# EAGLE design pedalboard (EAGLE 6.3)
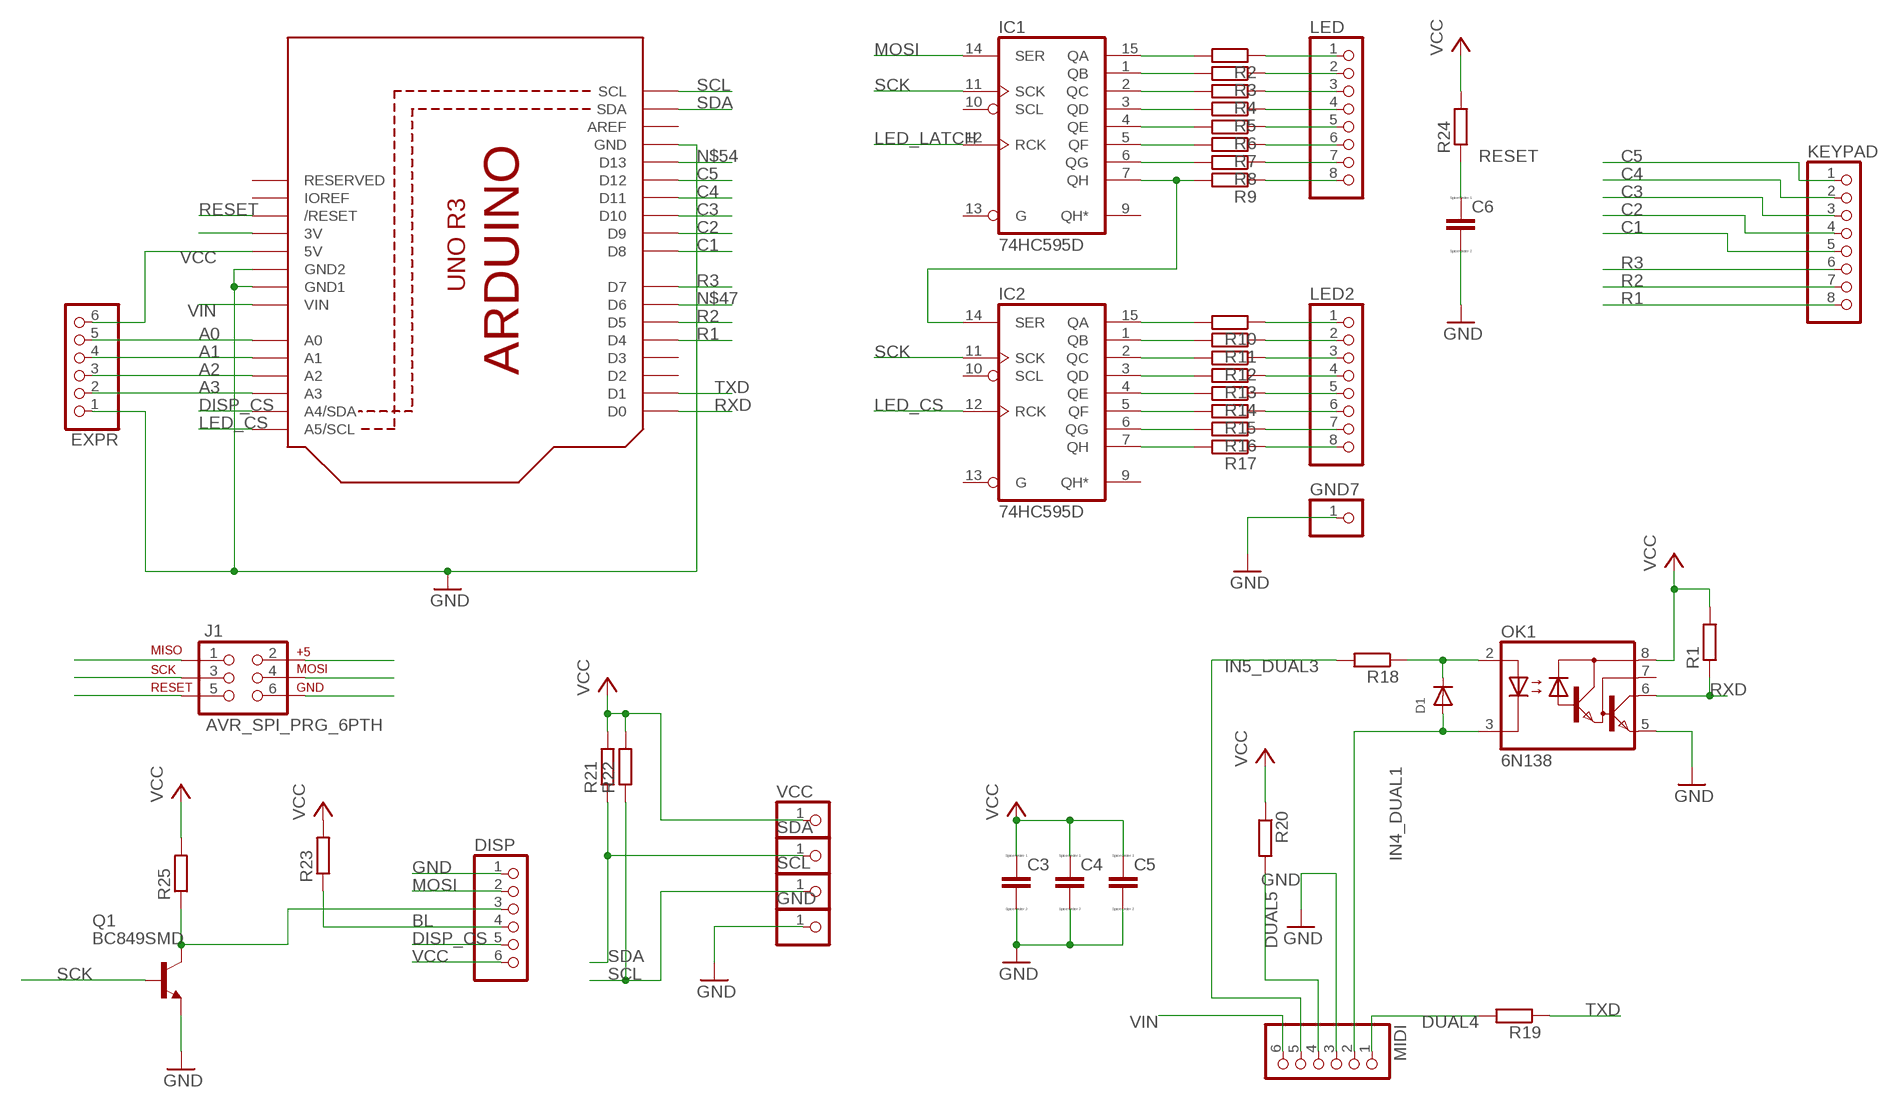
[diagram p0: schematic, sheet 1]

## Parts
C3  CC0603  [C0603]
C4  CC0603  [C0603]
C5  C  [C0805]
C6  CC0603  [C0603]
D1  DIODEDO-1N4148  [DO-1N4148]
DISP  PINHD-1X6  [1X06]
EXPR  PINHD-1X6  [1X06]
GND  PINHD-1X1  [1X01]
GND7  PINHD-1X1  [1X01]
IC1  74HC595D  [SO16]
IC2  74HC595D  [SO16]
J1  AVR_SPI_PRG_6PTH  [2X3]
KEYPAD  PINHD-1X8CLEANBIG  [1X08-CLEANBIG]
LED  PINHD-1X8CLEANBIG  [1X08-CLEANBIG]
LED2  PINHD-1X8CLEANBIG  [1X08-CLEANBIG]
MIDI  PINHD-1X6  [1X06]
OK1  6N138  [DIL08]
Q1  BC849SMD  [SOT23-BEC]
R1  R-EU_R0805  [R0805]
R2  R-EU_R0805  [R0805]
R3  R-EU_R0805  [R0805]
R4  R-EU_R0805  [R0805]
R5  R-EU_R0805  [R0805]
R6  R-EU_R0805  [R0805]
R7  R-EU_R0805  [R0805]
R8  R-EU_R0805  [R0805]
R9  R-EU_R0805  [R0805]
R10  R-EU_R0805  [R0805]
R11  R-EU_R0805  [R0805]
R12  R-EU_R0805  [R0805]
R13  R-EU_R0805  [R0805]
R14  R-EU_R0805  [R0805]
R15  R-EU_R0805  [R0805]
R16  R-EU_R0805  [R0805]
R17  R-EU_R0805  [R0805]
R18  R-EU_R0805  [R0805]
R19  R-EU_R0805  [R0805]
R20  R-EU_R0805  [R0805]
R21  R-EU_R0805  [R0805]
R22  R-EU_R0805  [R0805]
R23  R-EU_R0805  [R0805]
R24  R-EU_R0805  [R0805]
R25  R-EU_R0805  [R0805]
SCL  PINHD-1X1  [1X01]
SDA  PINHD-1X1  [1X01]
U2  ARDUINOR3-BPLACE  [ARDUINOR3-BPLACE]
VCC  PINHD-1X1  [1X01]

## Nets
A0: EXPR.5 U2.A0
A1: EXPR.4 U2.A1
A2: EXPR.3 U2.A2
A3: EXPR.2 U2.A3
BL: DISP.4 R23.1
C1: KEYPAD.5 U2.D8
C2: KEYPAD.4 U2.D9
C3: KEYPAD.3 U2.D10
C4: KEYPAD.2 U2.D11
C5: KEYPAD.1 U2.D12
DISP_CS: DISP.5 U2.A4(A4/SDA)
DUAL4: MIDI.1 R19.2
DUAL5: MIDI.4 R20.2
GND: C3.2 C4.2 C5.2 C6.2 DISP.1 EXPR.1 GND7.1 GND.1 J1.6 MIDI.3 OK1.5(GND) Q1.E U2.GND U2.GND1 U2.GND2
IN4_DUAL1: D1.A MIDI.2 OK1.3(C)
IN5_DUAL3: MIDI.5 R18.2
LED2: LED2.1 R10.1
LED_CS: IC2.12(RCK) U2.A5(A5/SCL)
LED_LATCH: IC1.12(RCK)
MISO: J1.1
MOSI: DISP.2 IC1.14(SER) J1.4
N$1: IC1.7(QH) IC2.14(SER) R9.2
N$2: IC2.4(QE) R14.2
N$3: IC2.5(QF) R15.2
N$4: IC1.15(QA) R2.2
N$5: IC1.1(QB) R3.2
N$6: IC1.2(QC) R4.2
N$7: IC1.3(QD) R5.2
N$8: IC1.4(QE) R6.2
N$9: IC1.5(QF) R7.2
N$10: IC1.6(QG) R8.2
N$11: IC2.15(QA) R10.2
N$12: IC2.1(QB) R11.2
N$13: IC2.2(QC) R12.2
N$14: IC2.3(QD) R13.2
N$15: IC2.6(QG) R16.2
N$16: IC2.7(QH) R17.2
N$17: DISP.3 Q1.C R25.1
N$18: D1.C OK1.2(A) R18.1
N$22: LED.1 R2.1
N$23: LED.2 R3.1
N$24: LED.3 R4.1
N$25: LED.4 R5.1
N$26: LED.5 R6.1
N$27: LED.6 R7.1
N$28: LED.7 R8.1
N$29: LED.8 R9.1
N$31: LED2.2 R11.1
N$32: LED2.3 R12.1
N$33: LED2.4 R13.1
N$34: LED2.5 R14.1
N$35: LED2.6 R15.1
N$36: LED2.7 R16.1
N$37: LED2.8 R17.1
N$47: U2.D6
N$54: U2.D13
N$63: U2.3V
R1: KEYPAD.8 U2.D4
R2: KEYPAD.7 U2.D5
R3: KEYPAD.6 U2.D7
RESET: C6.1 J1.5 R24.1 U2.RESET(/RESET)
RXD: OK1.6(VO) R1.1 U2.D0
SCK: IC1.11(SCK) IC2.11(SCK) J1.3 Q1.B
SCL: R22.1 SCL.1 U2.SCL
SDA: R21.1 SDA.1 U2.SDA
TXD: R19.1 U2.D1
VCC: C3.1 C4.1 C5.1 DISP.6 EXPR.6 J1.2 OK1.8(VCC) R1.2 R20.1 R21.2 R22.2 R23.2 R24.2 R25.2 U2.5V VCC.1
VIN: MIDI.6 U2.VIN
Unconnected: IC1.9(QH*) IC1.10(SCL) IC1.13(G) IC2.9(QH*) IC2.10(SCL) IC2.13(G) OK1.7(VB) U2.AREF U2.D2 U2.D3 U2.IOREF U2.RESERVED

## Power pins joined to a net without a drawn wire
GND: IC1.8(GND) IC2.8(GND)
VCC: IC1.16(VCC) IC2.16(VCC)

## Library data of the parts
C3-C6 = eagle-ltspice:C: CAPACITOR, European symbol; SPICEMODEL: NONE; SPICEPREFIX: C
D1 = adafruit:DIODE: Diode SMADIODE - SMA Surface Mount Package 20V 1A Schottky Diode Digikey: 641-1014-6-ND DO-1N4148 - Through Hole Small Current Diode SOD-123 20V 1 A (.5mV Vf) Schottky Diode - Digikey: MBRX120TPMSCT-ND SOD-323 10V 570mA (.38mV Vf, 3ns) Schottky Diode - Digikey: ZLLS410CT-ND SOD-523 30V 30mA Schottky Diode (RB751S-40TE61) - Digikey: RB751S-40TE61CT-ND SOT23-R/W - SOT23 Package (R = Solder Paste/Reflow Ovens, W = Hand-Soldering) BAT54Film 40V 300mA - Digikey: 497-7162-1-ND
DISP EXPR MIDI = adafruit:PINHD-1X6: PIN HEADER
GND GND7 SCL SDA VCC = adafruit:PINHD-1X1: Pin header 1x1 for 0.1" spacing With round pins
IC1 IC2 = 74xx-eu:74*595: 8-bit SHIFT REGISTER, output latch
J1 = SparkFun-Connectors:AVR_SPI_PRG_6: AVR ISP 6 Pin This is the reduced ISP connector for AVR programming. Common on Arduino. This footprint will take up less PCB space and can be used with a 10-pin to 6-pin adapter such as SKU: BOB-08508
KEYPAD LED LED2 = adafruit:PINHD-1X8: PIN HEADER
OK1 = optocoupler:6N138: MOTOROLA OPTO COUPLER; MF: VISHAY/TELEFUNKEN; MPN: 6N138; OC_FARNELL: 9860150; OC_NEWARK: 35K5294
Q1 = transistor-npn:BC849*: NPN Transistor
R1-R25 = rcl:R-EU_: RESISTOR, European symbol
U2 = adafruit:ARDUINOR3: This is a new object for the new Arduino R3 - with extra pins that you may want to use (such as IOref, and duplicated A4/A5

## Board
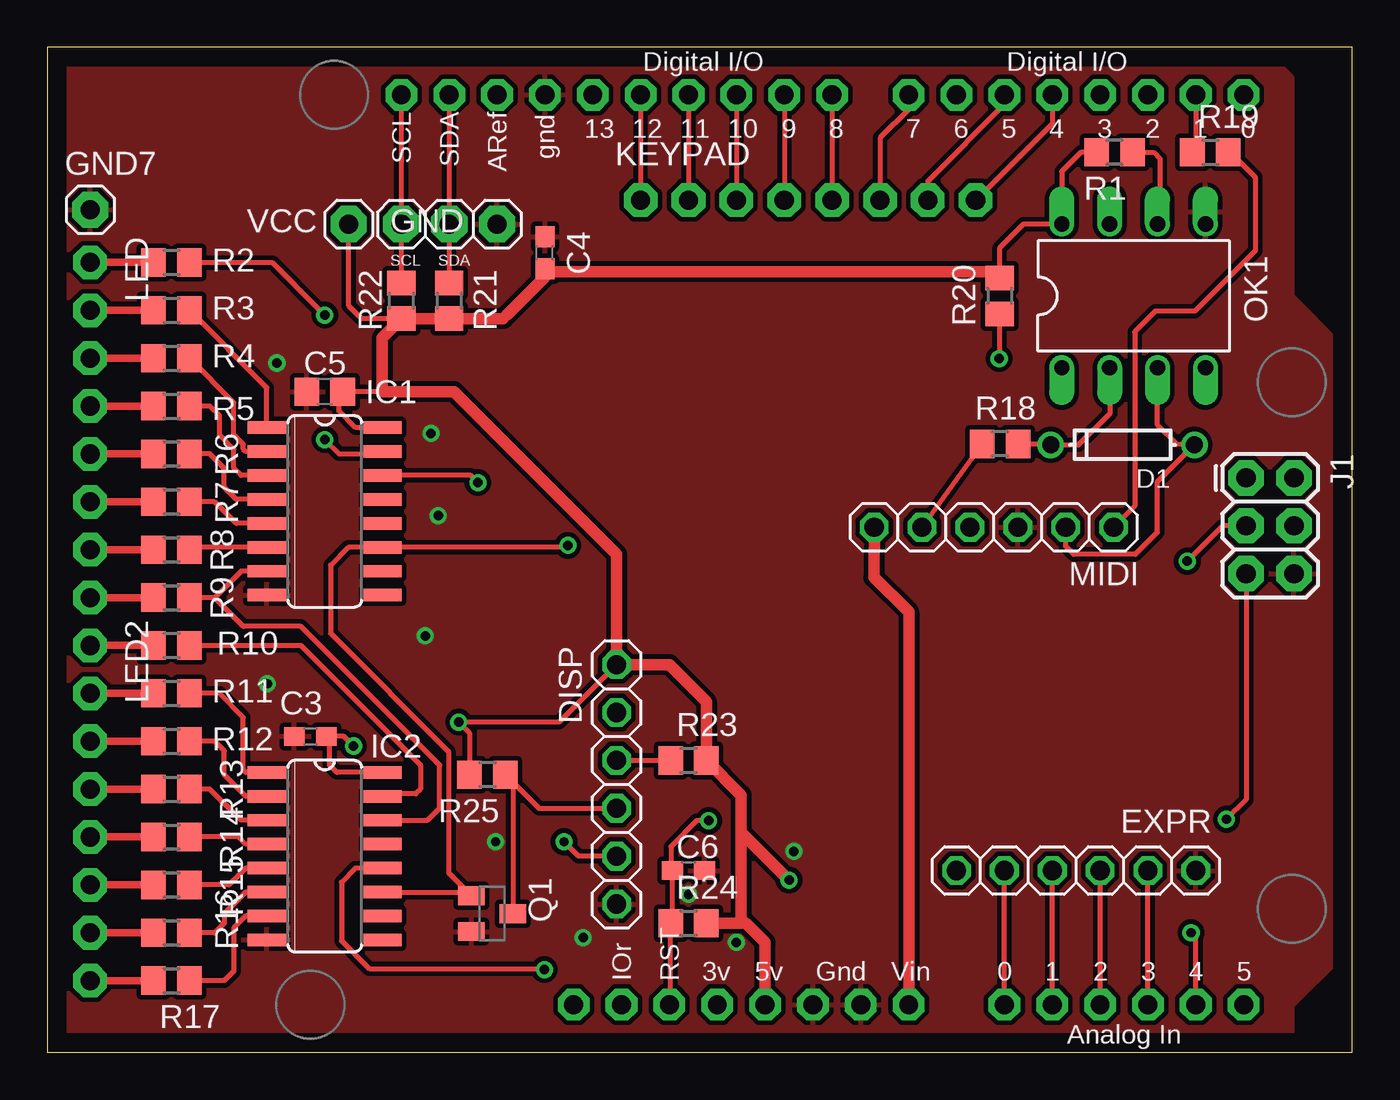
[diagram p1: board, top side]
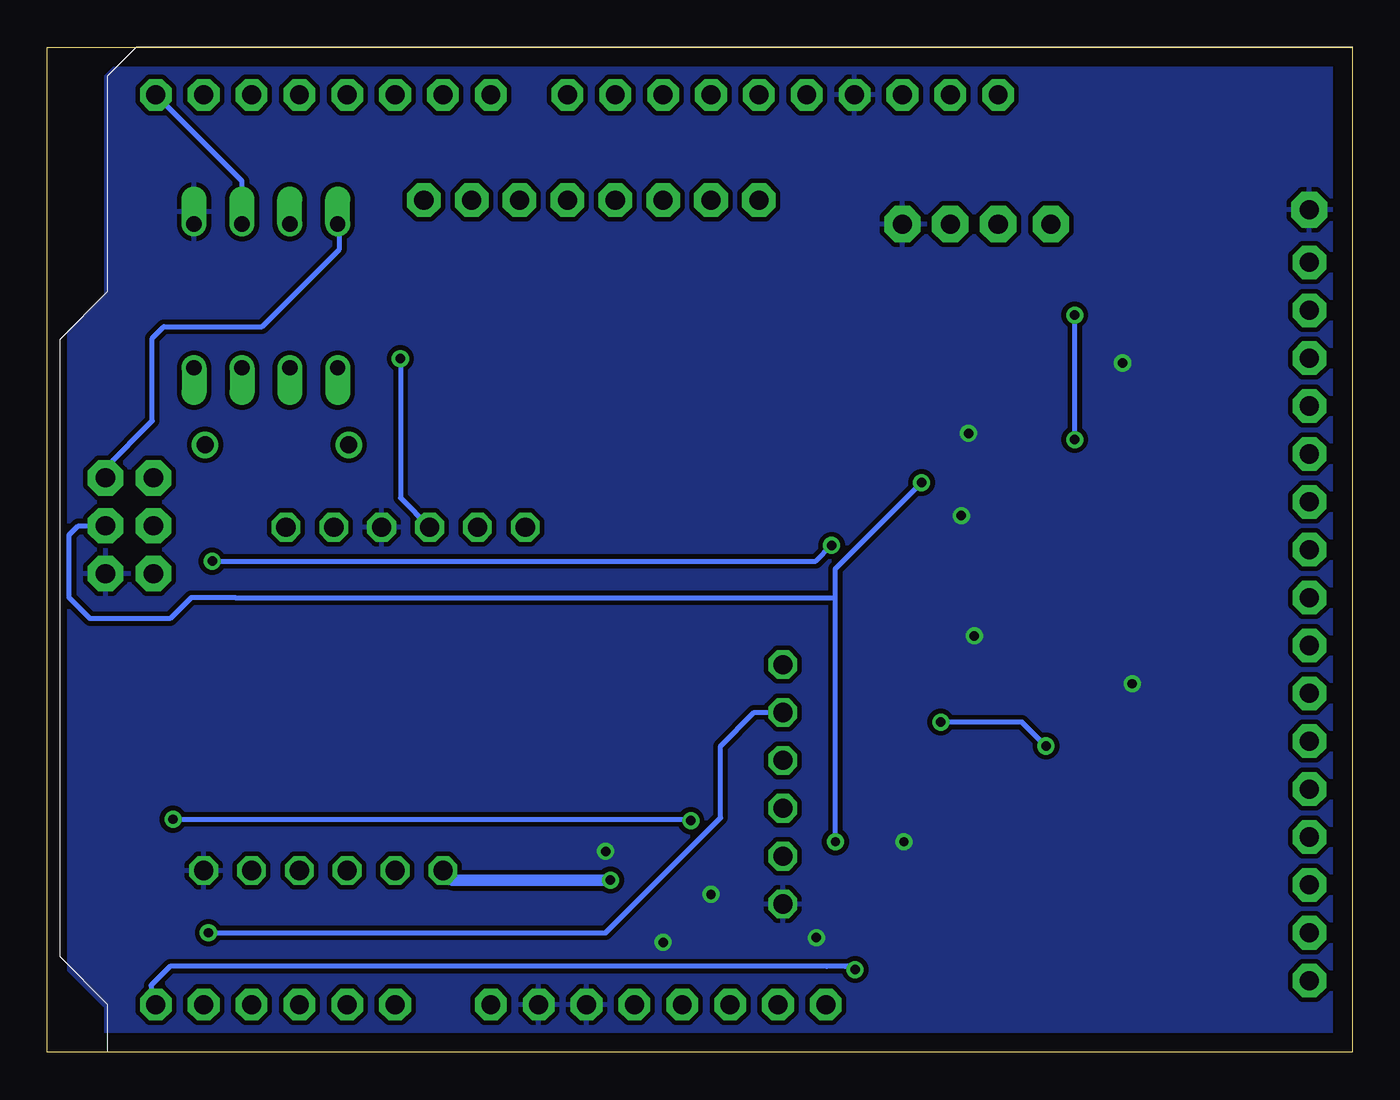
[diagram p2: board, bottom side, seen from below]

Size 69.27 x 53.33 mm. Coordinates in mm from the lower left corner, seen from the top.
Outline: 0,0 69.27,0 69.27,53.33 0,53.33 0,0
Copper layers (1*16): Top 0.035mm / dielectric 1.5mm / Bottom 0.035mm
Design rules "default *": minimum track width 10mil, minimum drill 12mil, track to track 10mil, track to pad 8mil, pad to pad 8mil, via to via 10mil, smd to smd 8mil, copper to edge 40mil, drill to drill 10mil, minimum pad ring 10mil, minimum via ring 8mil, stop-mask expansion 4mil, vias tented up to drill 0mil, thermal gap 10mil

### Footprints (pad centres in the part's own frame; a part is rotated, then mirrored left to right if it is on the bottom)
C0603 = smd 1.1 x 1: 1 -0.85,0; 2 0.85,0
C0805 = smd 1.3 x 1.5: 1 -0.95,0; 2 0.95,0
DO-1N4148 = drill 0.9: A -3.81,0; C 3.81,0
1X06 = drill 1.016 octagon: 1 -6.35,0; 2 -3.81,0; 3 -1.27,0; 4 1.27,0; 5 3.81,0; 6 6.35,0
1X01 = drill 1.016 pad 1.93 octagon: 1 0,0
SO16 = smd 0.66 x 2.032: 1 -4.445,-3.073; 2 -3.175,-3.073; 3 -1.905,-3.073; 4 -0.635,-3.073; 5 0.635,-3.073; 6 1.905,-3.073; 7 3.175,-3.073; 8 4.445,-3.073; 9 4.445,3.073; 10 3.175,3.073; 11 1.905,3.073; 12 0.635,3.073; 13 -0.635,3.073; 14 -1.905,3.073; 15 -3.175,3.073; 16 -4.445,3.073
2X3 = drill 1.016 pad 1.88 octagon: 1 0,0; 2 0,2.54; 3 2.54,0; 4 2.54,2.54; 5 5.08,0; 6 5.08,2.54
1X08-CLEANBIG = drill 1.016 pad 1.778 octagon: 1 -8.89,0; 2 -6.35,0; 3 -3.81,0; 4 -1.27,0; 5 1.27,0; 6 3.81,0; 7 6.35,0; 8 8.89,0
DIL08 = drill 0.813 offset: 1 -3.81,-3.81; 2 -1.27,-3.81; 3 1.27,-3.81; 4 3.81,-3.81; 5 3.81,3.81; 6 1.27,3.81; 7 -1.27,3.81; 8 -3.81,3.81
SOT23-BEC = smd 1 x 1.4: B -0.95,-1.1; C 0,1.1; E 0.95,-1.1
R0805 = smd 1.3 x 1.5: 1 -0.95,0; 2 0.95,0
ARDUINOR3-BPLACE = drill 1 pad 1.676 octagon: 3V 35.56,2.54; 5V 38.1,2.54; A0 50.8,2.54; A1 53.34,2.54; A2 55.88,2.54; A3 58.42,2.54; A4 60.96,2.54; A5 63.5,2.54; AREF 23.876,50.8; D0 63.5,50.8; D1 60.96,50.8; D2 58.42,50.8; D3 55.88,50.8; D4 53.34,50.8; D5 50.8,50.8; D6 48.26,50.8; D7 45.72,50.8; D8 41.656,50.8; D9 39.116,50.8; D10 36.576,50.8; D11 34.036,50.8; D12 31.496,50.8; D13 28.956,50.8; GND 26.416,50.8; GND1 43.18,2.54; GND2 40.64,2.54; IOREF 30.48,2.54; RESERVED 27.94,2.54; RESET 33.02,2.54; SCL 18.796,50.8; SDA 21.336,50.8; VIN 45.72,2.54

### Placement (x,y rotation side)
C3  13.97,16.76 180 top
C4  26.42,42.42 90 top
C5  14.73,35.05 180 top
C6  34.04,9.65 0 top
D1  57.07,32.23 180 top
DISP  30.23,14.22 90 top
EXPR  54.61,9.65 180 top
GND  23.88,43.94 0 top
GND7  2.29,44.7 0 top
IC1  14.73,28.7 270 top
IC2  14.73,10.41 270 top
J1  63.63,30.48 270 top
KEYPAD  40.39,45.21 0 top
LED  2.29,33.02 270 top
LED2  2.29,12.7 270 top
MIDI  50.24,27.86 180 top
OK1  57.66,40.13 0 top
Q1  23.62,7.37 270 top
R1  56.64,47.75 180 top
R2  6.6,41.91 0 top
R3  6.6,39.37 0 top
R4  6.6,36.83 0 top
R5  6.6,34.29 0 top
R6  6.6,31.75 0 top
R7  6.6,29.21 0 top
R8  6.6,26.67 0 top
R9  6.6,24.13 0 top
R10  6.6,21.59 0 top
R11  6.6,19.05 0 top
R12  6.6,16.51 0 top
R13  6.6,13.97 0 top
R14  6.6,11.43 0 top
R15  6.6,8.89 0 top
R16  6.6,6.35 0 top
R17  6.6,3.81 0 top
R18  50.57,32.28 180 top
R19  61.72,47.75 0 top
R20  50.55,40.13 270 top
R21  21.34,39.88 270 top
R22  18.8,39.88 270 top
R23  34.04,15.49 0 top
R24  34.04,6.86 0 top
R25  23.37,14.73 180 top
SCL  18.8,43.94 0 top
SDA  21.34,43.94 0 top
U2  0,0 0 top
VCC  16,43.94 0 top

### Tracks (layer width: path | path; a pad name or v marks a point on that pad's centre or on a via)
A0
  Top 0.254: U2.A0 EXPR.5
A1
  Top 0.254: U2.A1 EXPR.4
A2
  Top 0.254: U2.A2 EXPR.3
A3
  Top 0.254: U2.A3 EXPR.2
BL
  Top 0.254: DISP.4 R23.1
C1
  Top 0.254: U2.D8 KEYPAD.5
C2
  Top 0.254: U2.D9 KEYPAD.4
C3
  Top 0.254: U2.D10 KEYPAD.3
C4
  Top 0.254: U2.D11 KEYPAD.2
C5
  Top 0.254: U2.D12 KEYPAD.1
DISP_CS  (via drill 0.5)
  Top 0.254: U2.A4 60.96,6.1 v60.71,6.35
  Bottom 0.254: v60.71,6.35 39.62,6.35 33.53,12.45 33.53,16.26 31.75,18.03 DISP.5
DUAL4
  Top 0.254: R19.2 62.79,47.75 64.11,46.43 64.11,42.52 60.91,39.32 58.8,39.32 57.71,38.23 57.71,28.98 MIDI.1
DUAL5  (via drill 0.5)
  Top 0.254: R20.2 50.55,36.83 v50.52,36.8
  Bottom 0.254: v50.52,36.8 50.52,29.41 MIDI.4
GND  (via drill 0.5)
  other vias: 20.07,22.1 12.19,36.58 11.68,19.56 39.62,10.67 28.45,6.1 34.04,8.38 36.58,5.84 23.8,11.18 20.75,28.47 20.37,32.84
  pour Bottom: 0.18,53.26 64.62,53.26 66.14,51.74 66.14,40.13 68.68,37.59 68.68,4.93 68.61,4.93 66.22,2.54 66.14,2.54 66.14,0 0.18,0
  pour Top: 0.08,53.26 64.52,53.26 66.04,51.74 66.04,40.13 68.58,37.59 68.58,4.93 68.5,4.93 66.12,2.54 66.04,2.54 66.04,0 0.08,0
IN4_DUAL1
  Top 0.254: OK1.3 58.93,33.27 59.94,32.26 D1.A 58.93,30.28 58.93,27.58 57.76,26.42 54.48,26.42 54.05,26.85 MIDI.2
IN5_DUAL3
  Top 0.254: R18.2 MIDI.5
LED2
  Top 0.406: R10.1 LED2.1
LED_CS  (via drill 0.5)
  Top 0.254: IC2.12 16.36,9.78 15.62,9.04 15.62,5.92 17.09,4.45 26.34,4.45 v26.39,4.39
  Bottom 0.254: U2.A5 63.75,2.79 63.75,3.56 62.74,4.57 27.89,4.57 26.92,4.57 26.57,4.57 v26.39,4.39
MOSI  (via drill 0.5)
  Top 0.254: DISP.2 28.19,10.41 v27.43,11.18 | v22.86,30.23 22.48,30.61 IC1.14
  Bottom 0.254: v27.43,11.18 27.43,24.13 | 27.43,24.13 27.43,25.65 v22.86,30.23 | 27.43,24.13 59.28,24.13 61.62,24.13 62.74,23.01 66.98,23.01 68.1,24.13 68.1,27.46 67.61,27.94 J1.4
N$1
  Top 0.254: IC2.14 20.19,12.32 20.83,12.95 20.83,15.24 13.46,22.61 10.41,22.61 8.89,24.13 | 8.89,24.13 R9.2 | IC1.7 10.29,25.53 8.89,24.13
N$2
  Top 0.254: IC2.4 10.54,11.05 10.16,11.43 R14.2
N$3
  Top 0.254: IC2.5 10.54,9.78 9.65,8.89 R15.2
N$4  (via drill 0.5)
  Top 0.254: 8.38,41.91 R2.2 7.58,41.88 11.96,41.88 14.36,39.48 | v14.73,32.51 15.49,31.75 17.68,31.75 IC1.15 | 14.36,39.48 v14.73,39.12 14.36,39.48
  Bottom 0.254: v14.73,32.51 v14.73,39.12
N$5
  Top 0.254: IC1.1 11.66,35.27 R3.2
N$6
  Top 0.254: IC1.2 10.54,31.88 10.41,32 10.41,32.26 9.91,32.77 9.91,34.48 R4.2
N$7
  Top 0.254: IC1.3 10.29,30.61 9.91,30.99 9.91,32 9.14,32.77 9.14,33.78 8.64,34.29 R5.2
N$8
  Top 0.254: IC1.4 10.03,29.34 9.4,29.97 9.4,30.99 8.64,31.75 R6.2
N$9
  Top 0.254: IC1.5 10.03,28.07 8.89,29.21 R7.2
N$10
  Top 0.254: IC1.6 7.68,26.8 R8.2
N$11
  Top 0.254: R10.2 13.46,21.59 19.81,15.24 19.81,13.97 19.56,13.72 17.93,13.72 IC2.15
N$12
  Top 0.254: IC2.1 10.54,14.86 10.41,14.99 10.41,17.78 9.14,19.05 R11.2
N$13
  Top 0.254: IC2.2 10.54,13.59 9.4,14.73 9.4,16 8.89,16.51 R12.2
N$14
  Top 0.254: IC2.3 10.29,12.32 8.64,13.97 R13.2
N$15
  Top 0.254: IC2.6 10.54,8.51 9.4,7.37 9.4,6.86 8.89,6.35 R16.2
N$16
  Top 0.254: IC2.7 10.54,7.24 9.91,6.6 9.91,4.32 9.4,3.81 R17.2
N$17
  Top 0.254: Q1.C 24.72,14.33 R25.1 26.1,12.95 DISP.3
N$18
  Top 0.254: R18.1 53.21,32.28 D1.C 54.74,32.23 56.41,33.91 56.41,36.3 OK1.2
N$22
  Top 0.406: R2.1 LED.1
N$23
  Top 0.406: R3.1 LED.2
N$24
  Top 0.406: R4.1 LED.3
N$25
  Top 0.406: R5.1 LED.4
N$26
  Top 0.406: R6.1 LED.5
N$27
  Top 0.406: R7.1 LED.6
N$28
  Top 0.406: R8.1 LED.7
N$29
  Top 0.406: R9.1 LED.8
N$31
  Top 0.406: R11.1 LED2.2
N$32
  Top 0.406: R12.1 LED2.3
N$33
  Top 0.406: R13.1 LED2.4
N$34
  Top 0.406: R14.1 LED2.5
N$35
  Top 0.406: R15.1 LED2.6
N$36
  Top 0.406: R16.1 LED2.7
N$37
  Top 0.406: R17.1 LED2.8
R1
  Top 0.254: U2.D4 53.34,49.28 KEYPAD.8
R2
  Top 0.254: U2.D5 50.8,50.29 46.74,46.23 KEYPAD.7
R3
  Top 0.254: U2.D7 45.72,50.04 44.2,48.51 KEYPAD.6
RESET  (via drill 0.5)
  Top 0.254: U2.RESET 33.09,2.61 R24.1 33.19,6.96 C6.1 33.1,9.74 33.1,10.92 34.47,12.29 v35.1,12.29 | J1.5 63.63,13.41 v62.59,12.37
  Bottom 0.254: v62.59,12.37 35.18,12.37 v35.1,12.29
RXD
  Top 0.254: R1.1 58.73,47.75 59.05,47.42 59.05,44.07 OK1.6
  Bottom 0.254: OK1.6 58.93,46.23 U2.D0
SCK  (via drill 0.5)
  Top 0.254: IC2.11 22.33,8.51 Q1.B 21.31,9.53 21.31,15.95 15.04,22.23 15.04,25.86 15.98,26.8 IC1.11 27.53,26.8 v27.64,26.9 | J1.3 62.38,27.94 v60.5,26.06
  Bottom 0.254: v60.5,26.06 28.47,26.06 v27.64,26.9
SCL
  Top 0.254: U2.SCL SCL.1 R22.1
SDA
  Top 0.254: U2.SDA SDA.1 R21.1
TXD
  Top 0.254: U2.D1 60.96,47.94 R19.1
VCC  (via drill 0.5)
  Top 0.254: R22.2 16.7,38.93 16,39.62 VCC.1 | R1.2 54.86,47.75 53.85,46.74 OK1.8 51.82,43.94 50.55,42.67 R20.1 50.23,41.4 | R25.2 22.42,16.95 v21.84,17.53 27.18,17.53 DISP.6 | 37.08,6.86 36.83,6.86 | v16.26,16.26 15.75,16.76 C3.1 14.99,16.6 14.99,15.24 15.37,14.86 IC2.16 | 17.78,35.05 C5.1 15.49,34.96 15.49,34.04 16.38,33.15 IC1.16 | 17.8,37.94 17.78,37.91 | C4.1 26.42,41.4 26.42,41.15 | 24.38,39.12 24.2,38.93 | 36.83,11.68 36.83,12.19
  Top 0.61: 17.8,37.94 R22.2 R21.2 24.2,38.93 | U2.5V 38.1,5.84 37.08,6.86 | R24.2 36.83,6.86 36.83,12.19 36.83,13.65 R23.2 34.99,18.61 33.02,20.57 DISP.6 30.23,26.42 23.5,33.15 21.59,35.05 17.78,35.05 17.78,37.91 | 26.42,41.15 24.38,39.12 | 50.23,41.4 26.42,41.4 | v39.37,9.14 36.83,11.68
  Bottom 0.254: v16.26,16.26 17.53,17.53 v21.84,17.53 | J1.2 66.17,31.01 63.68,33.5 63.68,37.9 63.07,38.51 57.86,38.51 53.75,42.62 53.75,43.84 OK1.8
  Bottom 0.61: EXPR.6 47.75,9.14 v39.37,9.14
VIN
  Top 0.61: MIDI.6 43.87,25.2 45.72,23.37 U2.VIN